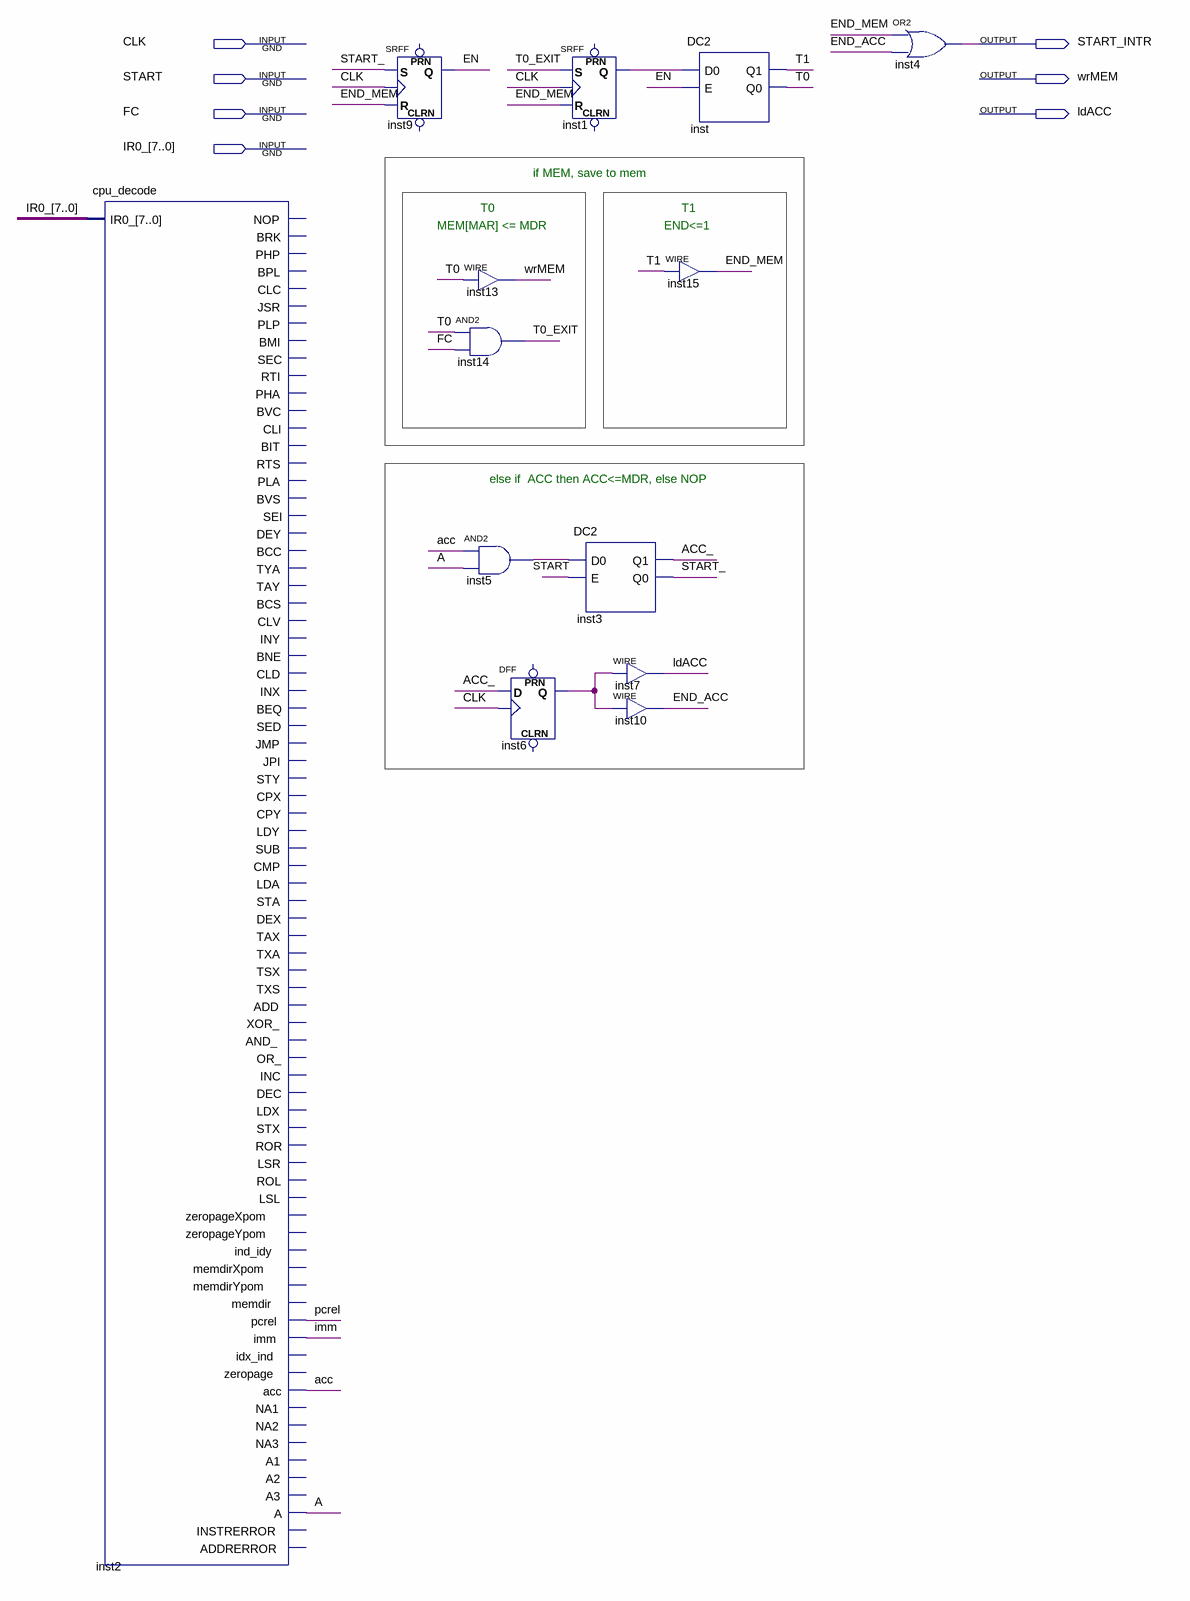
[diagram p0: schematic sheet]
// Quartus schematic cpu_store.bdf as structural Verilog: 13 symbols, 7 pins
module cpu_store (
  input  CLK,
  input  START,
  input  FC,
  input  [7:0] IR0_,
  output START_INTR,
  output wrMEM,
  output ldACC
);

  wire A, acc, ACC_, EN, END_ACC, END_MEM, imm, inst1_q, inst5_out, inst6_q, pcrel, START_, T0, T0_EXIT, T1;

  cpu_decode inst2 (
    .IR0_(IR0_), .pcrel(pcrel), .imm(imm), .acc(acc), .A(A));  // open: NOP, BRK, PHP, BPL, CLC, JSR, PLP, BMI, SEC, RTI, PHA, BVC, CLI, BIT, RTS, PLA, BVS, SEI, DEY, BCC, TYA, TAY, BCS, CLV, INY, BNE, CLD, INX, BEQ, SED, JMP, JPI, STY, CPX, CPY, LDY, SUB, CMP, LDA, STA, DEX, TAX, TXA, TSX, TXS, ADD, XOR_, AND_, OR_, INC, DEC, LDX, STX, ROR, LSR, ROL, LSL, zeropageXpom, zeropageYpom, ind_idy, memdirXpom, memdirYpom, memdir, idx_ind, zeropage, NA1, NA2, NA3, A1, A2, A3, INSTRERROR, ADDRERROR
  SRFF inst9 (.S(START_), .R(END_MEM), .CLK(CLK), .Q(EN));  // open: PRN, CLRN
  assign wrMEM = T0;  // WIRE inst13
  and inst14 (T0_EXIT, T0, FC);
  and inst5 (inst5_out, acc, A);
  SRFF inst1 (.S(T0_EXIT), .R(END_MEM), .CLK(CLK), .Q(inst1_q));  // open: PRN, CLRN
  DFF inst6 (.CLK(CLK), .D(ACC_), .Q(inst6_q));  // open: CLRN, PRN
  DC2 inst3 (.D0(inst5_out), .E(START), .Q1(ACC_), .Q0(START_));
  assign ldACC = inst6_q;  // WIRE inst7
  assign END_ACC = inst6_q;  // WIRE inst10
  DC2 inst (.D0(inst1_q), .E(EN), .Q1(T1), .Q0(T0));
  assign END_MEM = T1;  // WIRE inst15
  or inst4 (START_INTR, END_MEM, END_ACC);

  // Notes on the sheet:
  //   if MEM, save to mem
  //   T0
  //   T1
  //   MEM[MAR] <= MDR
  //   END<=1
  //   else if  ACC then ACC<=MDR, else NOP
endmodule
